# Altium schematic sheet circuit_breaker.SchDoc
size A
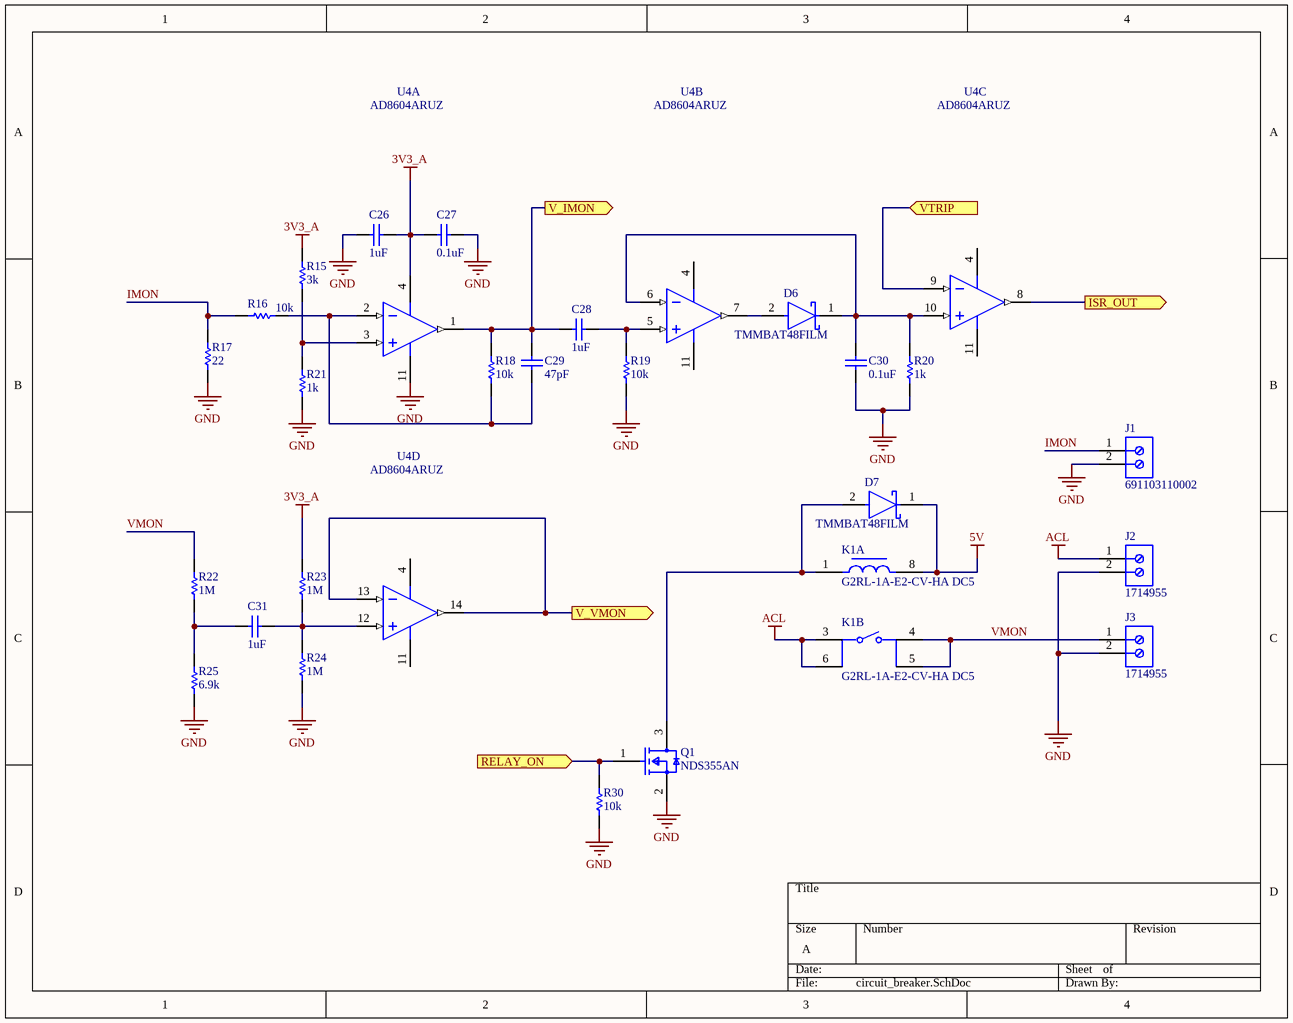
[diagram p0: circuit_breaker.SchDoc]

## Parts
C26  value 1uF  [0603C]  (hidden comment: 0603YD105MAT2A)
C27  value 0.1uF  [0603C]  (hidden comment: 06033C104K4T4A)
C28  value 1uF  [0603C]  (hidden comment: 0603YD105MAT2A)
C29  value 47pF  [0603C]  (hidden comment: CC0603KRNPO9BN470)
C30  value 0.1uF  [0603C]  (hidden comment: 06033C104K4T4A)
C31  value 1uF  [0603C]  (hidden comment: 0603YD105MAT2A)
D6  TMMBAT48FILM  [FP-MINIMELF-MFG]
D7  TMMBAT48FILM  [FP-MINIMELF-MFG]
J1  691103110002  [691103110002]
J2  1714955  [PHOE-1714955_V]
J3  1714955  [PHOE-1714955_V]
K1  G2RL-1A-E2-CV-HA DC5  [FP-G2RL-1A-E2-CV-HA-MFG]  (parts A,B of 2)
Q1  NDS355AN  [FP-527AG-01-IPC_C]
R15  value 3k  [0603R]  (hidden comment: ERA-3APB302V)
R16  value 10k  [0603R]  (hidden comment: ERA-3ARB103V)
R17  value 22  [0603R]  (hidden comment: RMCF0603JT22R0)
R18  value 10k  [0603R]  (hidden comment: ERA-3ARB103V)
R19  value 10k  [0603R]  (hidden comment: ERA-3ARB103V)
R20  value 1k  [0603R]  (hidden comment: ERJ-PB3D1001V)
R21  value 1k  [0603R]  (hidden comment: ERJ-PB3D1001V)
R22  value 1M  [0603R]  (hidden comment: ERJ-3GEYJ105V)
R23  value 1M  [0603R]  (hidden comment: ERJ-3GEYJ105V)
R24  value 1M  [0603R]  (hidden comment: ERJ-3GEYJ105V)
R25  value 6.9k  [0603R]  (hidden comment: ERJ-3EKF1692V)
R30  value 10k  [0603R]  (hidden comment: ERA-3ARB103V)
U4  AD8604ARUZ  [ADI-RU-14_M]  (parts A,B,C,D of 4)

## Ports
ISR_OUT (out), RELAY_ON (in), V_IMON (out), V_VMON (out), VTRIP (in)

## Nets
3V3_A: C26.2 C27.1 R15.2 R23.2 U4.4(+V)
5V: D7.1(C) K1.8
ACL: J2.1 K1.3 K1.6
GND: C26.1 C27.2 C30.1 J1.2 J2.2 J3.2 Q1.2(S) R17.1 R19.1 R20.1 R21.1 R24.1 R25.1 R30.1 U4.11(-V)
IMON: J1.1 R16.1 R17.2
ISR_OUT: U4.8(OUT_C) ; port ISR_OUT
RELAY_ON: Q1.1(G) R30.2 ; port RELAY_ON
V_IMON: C28.1 C29.2 R18.2 U4.1(OUT_A) ; port V_IMON
V_VMON: U4.13(-IN_D) U4.14(OUT_D) ; port V_VMON
VMON: J3.1 K1.4 K1.5 R22.2
VTRIP: U4.9(-IN_C) ; port VTRIP
NetC28_2: C28.2 R19.2 U4.5(+IN_B)
NetC29_1: C29.1 R16.2 R18.1 U4.2(-IN_A)
NetC30_2: C30.2 D6.1(C) R20.2 U4.6(-IN_B) U4.10(+IN_C)
NetC31_1: C31.1 R22.1 R25.2
NetC31_2: C31.2 R23.1 R24.2 U4.12(+IN_D)
NetD6_2: D6.2(A) U4.7(OUT_B)
NetD7_2: D7.2(A) K1.1 Q1.3(D)
NetR15_1: R15.1 R21.2 U4.3(+IN_A)

## Library data of the parts
C26 C28 C31 = 0603YD105MAT2A: AVX - 0603YD105MAT2A - Keramikvielschichtkondensator, SMD, 1 µF, 16 V, 0603 [Metrisch 1608], ± 20%, X5R, AVX 0603 MLCC; Manufacturer: Kyocera AVX; Voltage Rating (DC): 16V; Dissipation Factor: 3.5%; Supplier 2: Digi-Key; Manufacturer Part Number: 0603YD105MAT2A; RoHS: Yes; Category: Ceramic Capacitors; Stock 2: 32400; Pricing 2: 1=0.17000, 10=0.12100, 50=0.06880, 100=0.05700, 500=0.03998, 1000=0.03310 (USD); Mount: Surface Mount; Case/Package: 0603; Number of Pins: 2; Case Code (Metric): 1608; Case Code (Imperial): 0603; Min Operating Temperature: -55°C; Max Operating Temperature: 85°C; Capacitance: 1uF; Tolerance: 20%; Dielectric: X5R; Packaging: Tape and Reel; Voltage Rating: 16V; Package Quantity: 4000; Termination: SMD/SMT; Series: -; Construction: Flat; Length: 1.6mm; Width: 0.032inch; Height: 0.9mm; Depth: 0.81mm; Thickness: 0.035inch; Radiation Hardening: No; REACH SVHC: No SVHC; Lead Free: Lead Free; RoHS Compliant: Yes; ComponentLink1URL: https://datasheet.ciiva.com/151/cx5r-151029.pdf?src-supplier=Digi-Key; ComponentLink1Description: https://datasheet.ciiva.com/151/cx5r-151029.pdf?src-supplier=Digi-Key; ComponentLink2URL: https://datasheet.ciiva.com/151/cx5r-151030.pdf?src-supplier=Digi-Key; ComponentLink2Description: https://datasheet.ciiva.com/151/cx5r-151030.pdf?src-supplier=Digi-Key; ComponentLink3URL: https://datasheet.ciiva.com/151/cx5r-151031.pdf?src-supplier=Digi-Key; ComponentLink3Description: https://datasheet.ciiva.com/151/cx5r-151031.pdf?src-supplier=Digi-Key; ComponentLink4URL: https://datasheet.ciiva.com/22682/1666675-22682860.pdf?src-supplier=Element14; ComponentLink4Description: https://datasheet.ciiva.com/22682/1666675-22682860.pdf?src-supplier=Element14; ComponentLink5URL: https://datasheet.ciiva.com/28586/1666675-28586031.pdf?src-supplier=Element14; ComponentLink5Description: https://datasheet.ciiva.com/28586/1666675-28586031.pdf?src-supplier=Element14; Supplier Part Number 1: 478-5319-1-ND
C27 C30 = 06033C104K4T4A: Cap Ceramic 0.1uF 25V X7R 10% Pad SMD 0603 125C Automotive T/R; Manufacturer: Kyocera AVX; Capacitance: 100nF; Supplier Part Number 1: 478-10673-1-ND; Supplier 2: Digi-Key; Manufacturer Part Number: 06033C104K4T4A; RoHS: Yes; Category: Ceramic Capacitors; Stock 2: 4996; Pricing 2: 1=0.15000, 10=0.11000, 50=0.06220, 100=0.05150, 500=0.03612, 1000=0.02991, 2500=0.02784, 5000=0.02547 (USD); Mount: Surface Mount; Case/Package: 0603; Min Operating Temperature: -55°C; Max Operating Temperature: 125°C; Tolerance: 10%; Packaging: Tape and Reel; Dielectric: X7R; Voltage Rating (DC): 25V; Construction: Flat; Length: 1.6mm; Depth: 0.81mm; ComponentLink1URL: https://datasheet.ciiva.com/11503/cauto-11503964.pdf?src-supplier=Avnet; ComponentLink1Description: https://datasheet.ciiva.com/11503/cauto-11503964.pdf?src-supplier=Avnet
C29 = CC0603KRNPO9BN470: Cap Ceramic 47pF 50V C0G 10% SMD 0603 125C Paper T/R; Manufacturer: Yageo; Supplier 1: Digi-Key; Manufacturer Part Number: CC0603KRNPO9BN470; RoHS: Yes; Category: Ceramic Capacitors; Stock 1: 9137; Pricing 1: 1=0.10000, 10=0.05800, 50=0.03180, 100=0.02600, 500=0.01856, 1000=0.01458 (USD); Mount: Surface Mount; Case/Package: 0603; Case Code (Imperial): 0603; Case Code (Metric): 1608; Weight: 7.1E-05oz; Min Operating Temperature: -55°C; Max Operating Temperature: 125°C; Capacitance: 47pF; Tolerance: 10%; Dielectric: C0G; Voltage Rating (DC): 50V; Packaging: Tape and Reel; Termination: SMD/SMT; Resistor Type: Ceramic; Voltage Rating: 50V; Series: CC; Construction: Flat; Length: 0.063inch; Width: 0.031inch; Height: 0.8mm; Thickness: 0.035inch; Depth: 0.8mm; Radiation Hardening: No; RoHS Compliant: Yes; ComponentLink1URL: https://datasheet.ciiva.com/13264/upy-gp-np0-16v-to-50v-8-3714-13264856.pdf?src-supplier=Mouser; ComponentLink1Description: https://datasheet.ciiva.com/13264/upy-gp-np0-16v-to-50v-8-3714-13264856.pdf?src-supplier=Mouser; Supplier Part Number 1: 311-4037-1-ND
D6 D7 = CMP-12187-000003-1: DIODE SCHOTTKY 40V 350MA MINMELF; Manufacturer: STMicroelectronics; Max Surge Forward Current: 1.5A; Value: 20pF; Max Junction Temp: +125°C; Peak Reverse Current: 25uA; ComponentLink2Description: Datasheet; Manufacturer Part Number: TMMBAT48FILM; Height: 1.62mm; Forward Current: 350mA; Temperature: -65°C to +125°C; Max Repetitive Reverse Voltage: 40V; Category: Diode; Temperature Range Low: -65°C; Reverse Voltage: 40V; Device Class L3: Schottky Diodes; RoHS: TRUE; Digikey Description: DIODE SCHOTTKY 40V 350MA MINMELF; ComponentLink2URL: https://www.st.com/resource/en/datasheet/tmmbat48.pdf; Temperature Range High: +125°C; Octopart: https://octopart.com/tmmbat48film-stmicroelectronics-324396; Lead Free: Yes; Capacitance: 20pF; Device Class L1: Discrete Semiconductors; Device Class L2: Diodes; Automotive: No; Package: MINIMELF; Mouser Description: Schottky Diodes & Rectifiers 350mA 40 Volt
J1 = CMP-1502-03254-1: Series 1031 - 3.50 mm Horizontal Entry Modular with Pressure Clamp WR-TBL, 2 pin; Manufacturer: Wurth Elektronik; Pin Number: 2; Pitch: 3.50mm; Datasheet URL: http://katalog.we-online.de/em/datasheet/6911031100xx.pdf; Package Reference: 691103110002; Publisher: WurthElektronik; Manufacturer URL: http://www.we-online.de; Mounting Technology: THT; Operating Temperature: -40to105degC; Part Number: 691103110002; Packaging: Box
J2 J3 = CMP-2000-05797-1: PC Terminal Block, Pitch 6.35 mm, 1 x 2 Position, Height 21.5 mm, Tail Lenght 5.1 mm, RoHS, Bulk; Manufacturer: Phoenix Contact; Package Description: PC Terminal Block, Pitch 6.35 mm, 1 x 2 Position, Height 21.5 mm, Tail Lenght 5.1 mm; Datasheet URL: http://media.digikey.com/pdf/Data%20Sheets/Phoenix%20Contact%20PDFs/1714955.pdf; Package Reference: 1714955; Manufacturer URL: http://www.phoenixcontact.com/; Datasheet Version: 02/2010; Mounting Technology: ThroughHole
K1 = CMP-08822-000005-1: RELAY GEN PURPOSE SPST 23A 5V; Manufacturer: Omron; Number Of Contacts: 1; Throw Configuration: SPST-NO; Coil Resistance: 62.5Ω; Coil Current: 80mA; Description: General Purpose Relay SPST-NO (1 Form A) 5VDC Coil Through Hole; Coil Type: Non-Latching; Coil Power: 400mW; Coil Voltage: 5V; Height: 16.7mm; ComponentLink2Description: Datasheet; Lead Free: Yes; Manufacturer Part Number: G2RL-1A-E2-CV-HA DC5; Ambient Temperature Range High: +105°C; RoHS: TRUE; Category: Relay; ComponentLink2URL: https://media.digikey.com/pdf/Data%20Sheets/Omron%20PDFs/G2RL-1A-E2-CV-HA%20DC5.pdf; Switching Current: 23A; Temperature: -40°C to +105°C; Ambient Temperature Range Low: -40°C; Digikey Description: RELAY GEN PURPOSE SPST 23A 5V; Device Class L1: Electromechanical; Device Class L2: Relays; Package: G2RL-1A-E2-CV-HA; Octopart: https://octopart.com/g2rl-1a-e2-cv-ha+dc5-omron-100806975; Temperature Range High: +105°C; Current Rating: 23A; Temperature Range Low: -40°C; Automotive: No; Device Class L3: Power Relays
Q1 = CMP-2000-06834-2: MOSFET N-CH 30V 1.7A SSOT3; Manufacturer: ON Semiconductor; Gate To Source Voltage: 20V; Threshold Vgs Min: 1V; Pulse Drain Current: 10A; Number Of N Channels: 1; Typ Forward Diode Voltage: 0.8V; Input Capacitace At Vds: 195pF @ 15V; Turn Off Delay Time: 13ns; Gate Charge At Vgs: 3.5nC @ 5V; Rthja Max: 250°C/W; Standoff Height: 0.013mm; Max Forward Diode Voltage: 1.2V; Power Dissipation: 0.46W; Depletion Mode: False; Threshold Vgs Max: 2V; Drain To Source Resistance: 0.105Ω; Turn On Delay Time: 10ns; Max Junction Temp: +150°C; Transconductance: 3.5S; Automotive: No; Drain To Source Voltage: 30V; Temperature: -55°C to +150°C; Device Class L1: Discrete Semiconductors; Number Of Channels: 1; Octopart: https://octopart.com/nds355an-on+semiconductor-84330922; Temperature Range High: +150°C; Category: Trans; Manufacturer Part Number: NDS355AN; Device Class L2: Transistors; RoHS: TRUE; Digikey Description: MOSFET N-CH 30V 1.7A SSOT3; Drain To Source Breakdown Voltage: 30V; Height: 1.22mm; Mouser Description: MOSFET SOT-23 N-CH LOGIC; Temperature Range Low: -55°C; ComponentLink2URL: https://www.onsemi.com/pub/Collateral/NDS355AN-D.PDF; ComponentLink2Description: Datasheet; Continuous Drain Current: 1.7A; Package: 527AG-01; Device Class L3: MOSFETs; Lead Free: Yes; Footprint Url: https://www.onsemi.com/pub/Collateral/527AG.PDF
R15 = ERA-3APB302V: Resistor, SMD 220 Ohm 0603  ±  0.1 %, ERA3AEB221V, Panasonic Automotive & Industrial Systems; Supplier 1: Digi-Key; Supplier Part Number 1: P3.0KAYCT-ND
R16 R18 R19 R30 = ERA-3ARB103V: Resistor, SMD 10 kOhm 0603  ±  0.1 %, ERA3ARB103V, Panasonic Automotive & Industrial Systems; Resistance: 10kR; Tolerance: 0.1%; Temperature Coefficient: 10ppm/°C; Power Rating: 100mW; Voltage Rating: 75V; Voltage Rating (DC): 150V; Published: 8-Jun-2000; LatestRevisionDate: 17-Jul-2002; LatestRevisionNote: Re-released for DXP Platform.; PackageReference: 0603 MET; Publisher: Altium Limited; PackageDescription: Axial Device, Thru-Hole; 2 Leads; 0.3 in Pin Spacing; Supplier 1: Digi-Key; Manufacturer: Panasonic; Manufacturer Part Number: ERA-3ARB103V; RoHS: Yes; Category: Chip SMD Resistors; Stock 1: 16117; Pricing 1: 1=0.72000, 10=0.53000, 100=0.30890, 1000=0.17322, 2500=0.16973 (USD); Mount: Surface Mount; Case/Package: 0603; Number of Pins: 2; Contact Plating: Tin; Case Code (Metric): 1608; Case Code (Imperial): 0603; Min Operating Temperature: -55°C; Max Operating Temperature: 155°C; Resistor Type: Metal Film,Thin Film; Packaging: Tape and Reel; Package Quantity: 5000; Number of Terminations: 2; Termination: SMD/SMT; Max Power Dissipation: 100mW; Series: ERA-3A; Construction: Rectangular; Resistance Tolerance: 0.1%; Length: 1.6mm; Width: 0.031inch; Height: 0.022inch; Depth: 0.8mm; Radiation Hardening: No; REACH SVHC: No SVHC; Military Standard: Not; Lead Free: Lead Free; RoHS Compliant: Yes; ComponentLink1URL: https://datasheet.ciiva.com/48425/era-eng-tds-48425501.pdf?src-supplier=Distrelec; ComponentLink1Description: https://datasheet.ciiva.com/48425/era-eng-tds-48425501.pdf?src-supplier=Distrelec; ComponentLink2URL: https://datasheet.ciiva.com/17212/aoa0000ce26-17212075.pdf?src-supplier=Avnet+Europe; ComponentLink2Description: https://datasheet.ciiva.com/17212/aoa0000ce26-17212075.pdf?src-supplier=Avnet+Europe; Supplier Part Number 1: P10KBDCT-ND
R17 = RMCF0603JT22R0: Resistor, SMD 220 Ohm 0603  ±  0.1 %, ERA3AEB221V, Panasonic Automotive & Industrial Systems; Supplier 1: Digi-Key; Supplier Part Number 1: RMCF0603JT22R0CT-ND
R20 R21 = ERJ-PB3D1001V: PANASONIC - ERJ-PB3D1001V - CHIP RES, THICK FILM, 1K, 0.2W, 0603; Resistance: 1kR; Tolerance: 0.5%; Max Power Dissipation: 200mW; Temperature Coefficient: 50ppm/°C; Supplier 1: Digi-Key; Manufacturer: Panasonic; Manufacturer Part Number: ERJ-PB3D1001V; RoHS: Yes; Category: Chip SMD Resistors; Stock 1: 4491; Pricing 1: 1=0.16000, 10=0.13500, 25=0.09840, 50=0.07140, 100=0.05290, 250=0.04060, 500=0.03198, 1000=0.02214 (USD); Case/Package: 0603; Case Code (Metric): 1608; Case Code (Imperial): 0603; Min Operating Temperature: -55°C; Max Operating Temperature: 155°C; Packaging: Tape and Reel; Resistor Type: Thick Film; Number of Terminations: 2; Features: Automotive AEC-Q200; Length: 0.063inch; Width: 0.032inch; Height - Seated (Max): 0.022inch; ComponentLink1URL: https://industrial.panasonic.com/cdbs/www-data/pdf/RDM0000/DMM0000COL5.pdf?src-supplier=Digi-Key; ComponentLink1Description: https://industrial.panasonic.com/cdbs/www-data/pdf/RDM0000/DMM0000COL5.pdf?src-supplier=Digi-Key; ComponentLink2URL: https://industrial.panasonic.com/sa/system/files/data/download/catalog/id_fixed-resistors_e_2.pdf?src-supplier=Digi-Key; ComponentLink2Description: https://industrial.panasonic.com/sa/system/files/data/download/catalog/id_fixed-resistors_e_2.pdf?src-supplier=Digi-Key; ComponentLink3URL: http://www.farnell.com/datasheets/2286937.pdf?src-supplier=Newark; ComponentLink3Description: http://www.farnell.com/datasheets/2286937.pdf?src-supplier=Newark; Supplier Part Number 1: P20283CT-ND
R22-R24 = ERJ-3GEYJ105V: Resistor, SMD 220 Ohm 0603  ±  0.1 %, ERA3AEB221V, Panasonic Automotive & Industrial Systems; Supplier 1: Digi-Key; Supplier Part Number 1: P1.0MGCT-ND
R25 = ERJ-3EKF1692V: Resistor, SMD 220 Ohm 0603  ±  0.1 %, ERA3AEB221V, Panasonic Automotive & Industrial Systems; Supplier 1: Digi-Key; Supplier Part Number 1: P16.9KHCT-ND
U4 = CMP-0384-01895-1: Quad Channel Wide Bandwidth Operational Amplifier, 8.4 MHz BW, 6 V/us SR, Industrial, 14-pin SOP (RU-14), Tube; Manufacturer: Analog Devices; Generic Part Number: AD8604; V Span Min: 2.7V; Input Offset Voltage: 500uV; Input Bias Current: 200fA; Iq/Amp: 1.2mA; Slew Rate: 6V/us; Amplifiers Per Package: 4; Small Signal Bandwidth: 8.4MHz; V Span Max: 6V; ComponentLink3Description: Package Specification; PartNumber: AD8604ARUZ; ComponentLink1URL: http://www.analog.com/en/index.html; ComponentLink1Description: Manufacturer URL; ComponentLink2URL: http://www.analog.com/static/imported-files/data_sheets/AD8601_8602_8604.pdf; DatasheetVersion: Rev. G; PackageDescription: 14-Pin Thin Shrink Small Outline Package, Body 5 x 4.4 mm, Pitch 0.65 mm; ComponentLink2Description: Datasheet; Mounting Technology: Surface Mount; Code_JEDEC: MO-153AB-1; ComponentLink3URL: http://www.analog.com/static/imported-files/packages/36057385283879153717235186773RU14.pdf; PackageReference: RU-14